# Altium schematic sheet 第一路数字隔离原理图.SchDoc
size A4
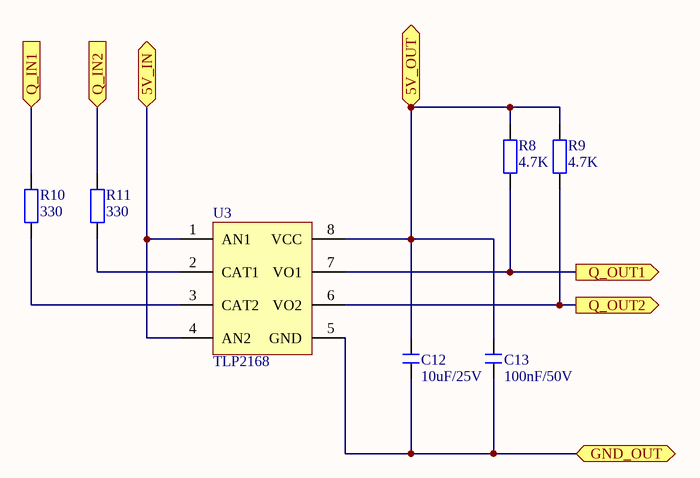
[diagram p0: 第一路数字隔离原理图.SchDoc]

## Parts
C12  10uF/25V  [C 0603_M]
C13  100nF/50V  [C 0603_M]
R8  4.7K  [R 0603_M]
R9  4.7K  [R 0603_M]
R10  330  [R 0603_M]
R11  330  [R 0603_M]
U3  TLP2168  [SOP8_N]

## Ports
5V_IN (bidir), 5V_OUT (bidir), GND_OUT (bidir), Q_IN1 (in), Q_IN2 (in), Q_OUT1 (out), Q_OUT2 (out)

## Nets
5V_IN: U3.1(AN1) U3.4(AN2) ; port 5V_IN
5V_OUT: C12.1 C13.2 R8.2 R9.2 U3.8(VCC) ; port 5V_OUT
GND_OUT: C12.2 C13.1 U3.5(GND) ; port GND_OUT
Q_IN1: R10.2 ; port Q_IN1
Q_IN2: R11.2 ; port Q_IN2
Q_OUT1: R8.1 U3.7(VO1) ; port Q_OUT1
Q_OUT2: R9.1 U3.6(VO2) ; port Q_OUT2
NetR10_1: R10.1 U3.3(CAT2)
NetR11_1: R11.1 U3.2(CAT1)

## Library data of the parts
C12 C13 = C: 无极性贴片电容; 版权归属: 源创客; 材质: X7R; BOM名称: 无极性贴片电容; 学习资源: www.ooocke.com
R8-R11 = R: 贴片电阻; 版权归属: 源创客; BOM名称: 贴片电阻; 学习资源: www.ooocke.com
U3 = TLP2168: 高速双通道隔离光耦